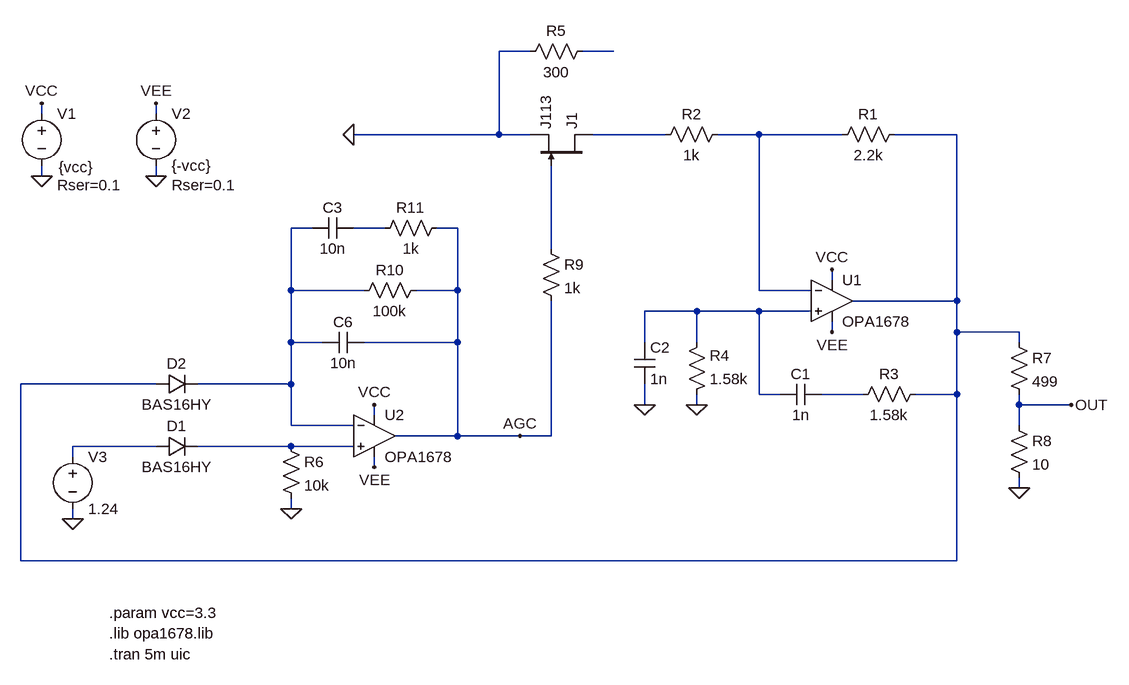
[diagram p0: schematic wien.asc]
wien.asc, the LTspice schematic file:
Version 4
SHEET 1 1832 1112
WIRE 368 -240 320 -240
WIRE 496 -240 448 -240
WIRE -384 -144 -384 -160
WIRE -208 -144 -208 -160
WIRE 320 -112 320 -240
WIRE 320 -112 96 -112
WIRE 368 -112 320 -112
WIRE 576 -112 464 -112
WIRE 720 -112 656 -112
WIRE 848 -112 720 -112
WIRE 1024 -112 928 -112
WIRE -384 -48 -384 -64
WIRE -208 -48 -208 -64
WIRE 32 32 0 32
WIRE 144 32 96 32
WIRE 256 32 224 32
WIRE 400 64 400 -64
WIRE 832 112 832 96
WIRE 0 128 0 32
WIRE 112 128 0 128
WIRE 256 128 256 32
WIRE 256 128 192 128
WIRE 720 128 720 -112
WIRE 800 128 720 128
WIRE 1024 144 1024 -112
WIRE 1024 144 864 144
WIRE 624 160 544 160
WIRE 720 160 624 160
WIRE 800 160 720 160
WIRE 832 192 832 176
WIRE 1024 192 1024 144
WIRE 1120 192 1024 192
WIRE 0 208 0 128
WIRE 48 208 0 208
WIRE 256 208 256 128
WIRE 256 208 112 208
WIRE 544 208 544 160
WIRE 624 208 624 160
WIRE 1120 208 1120 192
WIRE -208 272 -416 272
WIRE 0 272 0 208
WIRE 0 272 -144 272
WIRE 720 288 720 160
WIRE 752 288 720 288
WIRE 880 288 816 288
WIRE 1024 288 1024 192
WIRE 1024 288 960 288
WIRE 544 304 544 272
WIRE 624 304 624 288
WIRE 1120 304 1120 288
WIRE 1200 304 1120 304
WIRE 128 320 128 304
WIRE 0 336 0 272
WIRE 96 336 0 336
WIRE 1120 336 1120 304
WIRE 256 352 256 208
WIRE 256 352 160 352
WIRE 352 352 256 352
WIRE 400 352 400 144
WIRE 400 352 352 352
WIRE -208 368 -336 368
WIRE 0 368 -144 368
WIRE 96 368 0 368
WIRE -336 384 -336 368
WIRE 128 400 128 384
WIRE 1120 432 1120 416
WIRE 0 464 0 448
WIRE -336 480 -336 464
WIRE -416 544 -416 272
WIRE 1024 544 1024 288
WIRE 1024 544 -416 544
FLAG -384 -48 0
FLAG -208 -48 0
FLAG -384 -160 VCC
FLAG -208 -160 VEE
FLAG 832 96 VCC
FLAG 832 192 VEE
FLAG 624 304 0
FLAG 544 304 0
FLAG 96 -112 0
FLAG 128 304 VCC
FLAG 128 400 VEE
FLAG -336 480 0
FLAG 0 464 0
FLAG 1120 432 0
FLAG 352 352 AGC
FLAG 1200 304 OUT
SYMBOL voltage -384 -160 R0
WINDOW 3 26 98 Left 2
WINDOW 123 0 0 Left 0
WINDOW 39 24 126 Left 2
SYMATTR Value {vcc}
SYMATTR SpiceLine Rser=0.1
SYMATTR InstName V1
SYMBOL voltage -208 -160 R0
WINDOW 123 0 0 Left 0
WINDOW 39 24 126 Left 2
SYMATTR SpiceLine Rser=0.1
SYMATTR InstName V2
SYMATTR Value {-vcc}
SYMBOL res 944 -128 R90
WINDOW 0 0 56 VBottom 2
WINDOW 3 32 56 VTop 2
SYMATTR InstName R1
SYMATTR Value 2.2k
SYMBOL res 672 -128 R90
WINDOW 0 0 56 VBottom 2
WINDOW 3 32 56 VTop 2
SYMATTR InstName R2
SYMATTR Value 1k
SYMBOL res 976 272 R90
WINDOW 0 0 56 VBottom 2
WINDOW 3 32 56 VTop 2
SYMATTR InstName R3
SYMATTR Value 1.58k
SYMBOL res 608 304 M180
WINDOW 0 36 76 Left 2
WINDOW 3 36 40 Left 2
SYMATTR InstName R4
SYMATTR Value 1.58k
SYMBOL cap 816 272 R90
WINDOW 0 0 32 VBottom 2
WINDOW 3 32 32 VTop 2
SYMATTR InstName C1
SYMATTR Value 1n
SYMBOL cap 528 208 R0
SYMATTR InstName C2
SYMATTR Value 1n
SYMBOL Opamps\\opamp2 832 80 R0
SYMATTR InstName U1
SYMATTR Value OPA1678
SYMBOL Opamps\\opamp2 128 288 R0
SYMATTR InstName U2
SYMATTR Value OPA1678
SYMBOL voltage -336 368 R0
WINDOW 123 0 0 Left 0
WINDOW 39 0 0 Left 0
SYMATTR InstName V3
SYMATTR Value 1.24
SYMBOL njf 464 -64 M270
SYMATTR InstName J1
SYMATTR Value J113
SYMBOL cap 112 192 R90
WINDOW 0 0 32 VBottom 2
WINDOW 3 32 32 VTop 2
SYMATTR InstName C6
SYMATTR Value 10n
SYMBOL diode -208 384 R270
WINDOW 0 32 32 VTop 2
WINDOW 3 0 32 VBottom 2
SYMATTR InstName D1
SYMATTR Value BAS16HY
SYMBOL diode -208 288 R270
WINDOW 0 32 32 VTop 2
WINDOW 3 0 32 VBottom 2
SYMATTR InstName D2
SYMATTR Value BAS16HY
SYMBOL res -16 352 R0
SYMATTR InstName R6
SYMATTR Value 10k
SYMBOL res 1104 192 R0
SYMATTR InstName R7
SYMATTR Value 499
SYMBOL res 1104 320 R0
SYMATTR InstName R8
SYMATTR Value 10
SYMBOL res 384 48 R0
SYMATTR InstName R9
SYMATTR Value 1k
SYMBOL res 464 -256 R90
WINDOW 0 0 56 VBottom 2
WINDOW 3 32 56 VTop 2
SYMATTR InstName R5
SYMATTR Value 300
SYMBOL res 208 112 R90
WINDOW 0 0 56 VBottom 2
WINDOW 3 32 56 VTop 2
SYMATTR InstName R10
SYMATTR Value 100k
SYMBOL res 240 16 R90
WINDOW 0 0 56 VBottom 2
WINDOW 3 32 56 VTop 2
SYMATTR InstName R11
SYMATTR Value 1k
SYMBOL cap 96 16 R90
WINDOW 0 0 32 VBottom 2
WINDOW 3 32 32 VTop 2
SYMATTR InstName C3
SYMATTR Value 10n
TEXT -280 688 Left 2 !.tran 5m uic
TEXT -280 624 Left 2 !.param vcc=3.3
TEXT -280 656 Left 2 !.lib opa1678.lib

The netlist it stands for:
* wien.asc
V1 VCC 0 {vcc} Rser=0.1
V2 VEE 0 {-vcc} Rser=0.1
R1 N004 N003 2.2k
R2 N003 N002 1k
R3 N004 N009 1.58k
R4 0 N008 1.58k
C1 N009 N008 1n
C2 N008 0 1n
XU1 N008 N003 VCC VEE N004 OPA1678  ; pins In+ In- V+ V- OUT
XU2 N011 N005 VCC VEE AGC OPA1678  ; pins In+ In- V+ V- OUT
V3 N010 0 1.24
J1 N002 N007 0 J113
C6 AGC N005 10n
D1 N010 N011 BAS16HY
D2 N004 N005 BAS16HY
R6 N011 0 10k
R7 N004 OUT 499
R8 OUT 0 10
R9 N007 AGC 1k
R5 N001 0 300
R10 AGC N005 100k
R11 AGC N006 1k
C3 N006 N005 10n
.model D D
.lib standard.dio
.model NJF NJF
.model PJF PJF
.lib standard.jft
.tran 5m uic
.param vcc=3.3
.lib opa1678.lib
.backanno
.end